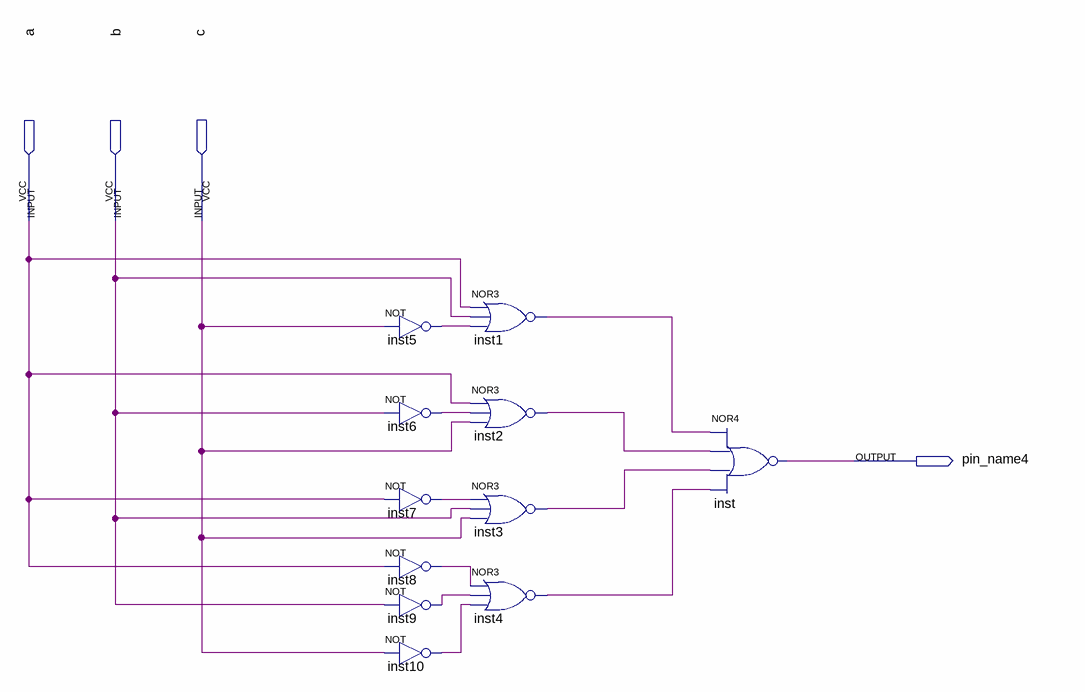
[diagram p0: schematic sheet]
// Quartus schematic designB.bdf as structural Verilog: 11 symbols, 4 pins
module designB (
  input  a,
  input  b,
  input  c,
  output pin_name4
);

  wire inst1_out, inst2_out, inst3_out, inst4_out, inst5_out, inst6_out, inst7_out, inst8_out, inst9_out,
       inst10_out;

  not inst5 (inst5_out, c);
  not inst6 (inst6_out, b);
  not inst7 (inst7_out, a);
  not inst8 (inst8_out, a);
  not inst9 (inst9_out, b);
  not inst10 (inst10_out, c);
  nor inst1 (inst1_out, a, b, inst5_out);
  nor inst2 (inst2_out, a, inst6_out, c);
  nor inst3 (inst3_out, inst7_out, b, c);
  nor inst4 (inst4_out, inst8_out, inst9_out, inst10_out);
  nor inst (pin_name4, inst1_out, inst2_out, inst3_out, inst4_out);
endmodule
